# Altium schematic sheet 12V_to_0V9.SchDoc: 12V to 0V9 Converter
size B; DocumentNumber: 35; SheetNumber: 35; SheetTotal: 46
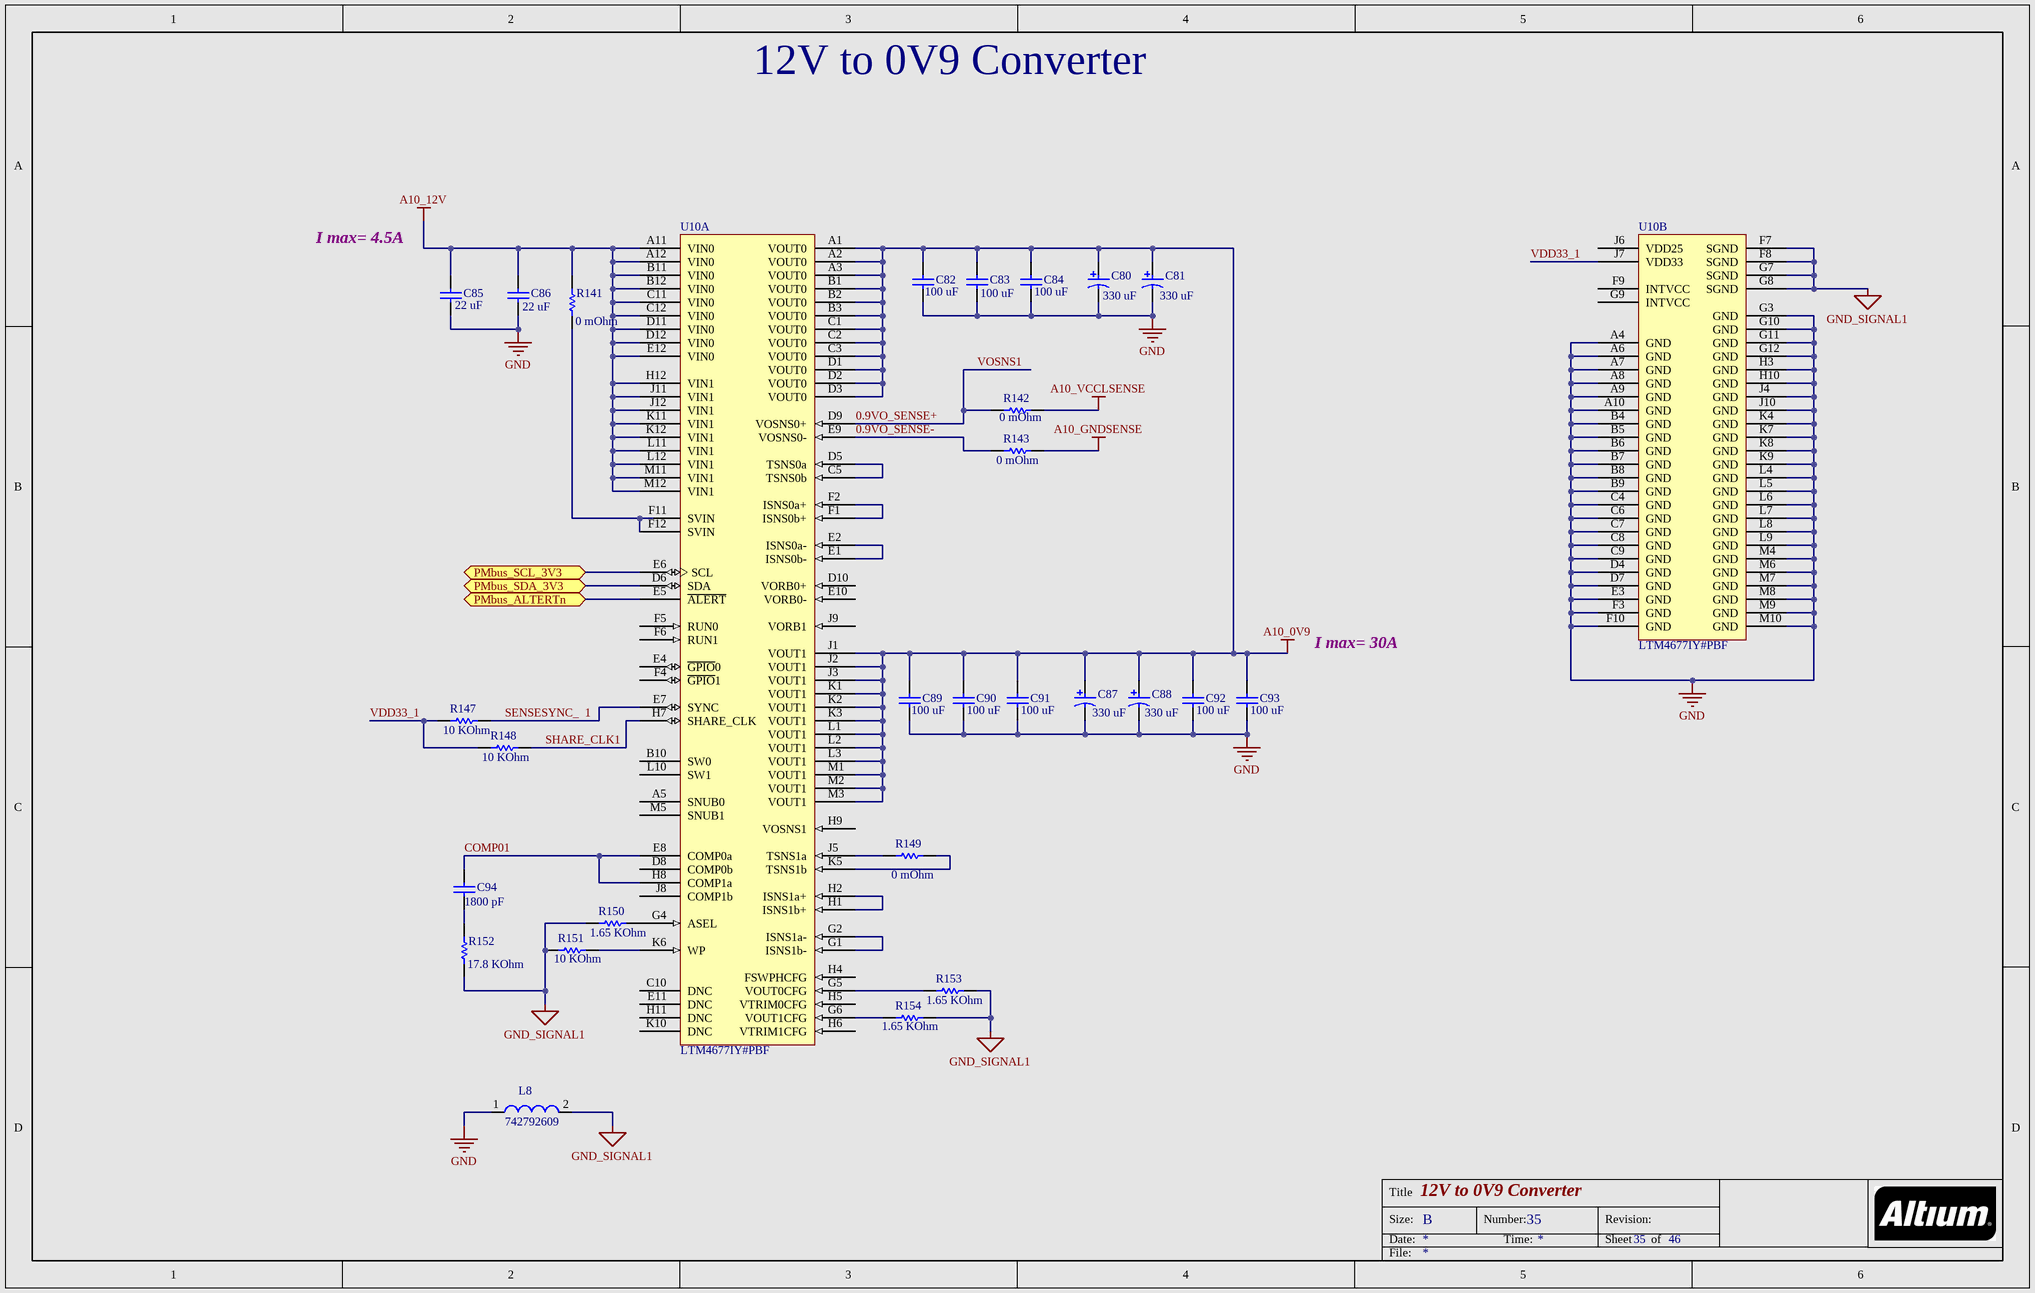
[diagram p0: 12V_to_0V9.SchDoc]

## Parts
(Parts that share a designator on the sheet are numbered #1, #2 ... from top to bottom, then left to right.)
C80  Capacitance: 330 uF  [PNSC-TPF-D3L_V]  (hidden comment: 6TPF330M9L)
C81  Capacitance: 330 uF  [PNSC-TPF-D3L_V]  (hidden comment: 6TPF330M9L)
C82  Capacitance: 100 uF  [CAPC3216X190X55ML30T25]  (hidden comment: GRM31CR60J107ME39L)
C83  Capacitance: 100 uF  [CAPC3216X190X55ML30T25]  (hidden comment: GRM31CR60J107ME39L)
C84  Capacitance: 100 uF  [CAPC3216X190X55ML30T25]  (hidden comment: GRM31CR60J107ME39L)
C85  Capacitance: 22 uF  [CAPC3216X180X55ML20T25]  (hidden comment: GRM31CR61E226KE15L)
C86  Capacitance: 22 uF  [CAPC3216X180X55ML20T25]  (hidden comment: GRM31CR61E226KE15L)
C87  Capacitance: 330 uF  [PNSC-TPF-D3L_V]  (hidden comment: 6TPF330M9L)
C88  Capacitance: 330 uF  [PNSC-TPF-D3L_V]  (hidden comment: 6TPF330M9L)
C89  Capacitance: 100 uF  [CAPC3216X190X55ML30T25]  (hidden comment: GRM31CR60J107ME39L)
C90  Capacitance: 100 uF  [CAPC3216X190X55ML30T25]  (hidden comment: GRM31CR60J107ME39L)
C91  Capacitance: 100 uF  [CAPC3216X190X55ML30T25]  (hidden comment: GRM31CR60J107ME39L)
C92  Capacitance: 100 uF  [CAPC3216X190X55ML30T25]  (hidden comment: GRM31CR60J107ME39L)
C93  Capacitance: 100 uF  [CAPC3216X190X55ML30T25]  (hidden comment: GRM31CR60J107ME39L)
C94  Capacitance: 1800 pF  [CAPC1005X55X23NL05T8]  (hidden comment: VJ0402Y182JXJCW1BC)
L8  742792609  [SMD-0603]
R141  Resistance: 0 mOhm  [RESC1005X40X25ML05T05]  (hidden comment: ERJ-2GE0R00X)
R142  Resistance: 0 mOhm  [RESC1005X40X25ML05T05]  (hidden comment: ERJ-2GE0R00X)
R143  Resistance: 0 mOhm  [RESC1005X40X25ML05T05]  (hidden comment: ERJ-2GE0R00X)
R147  Resistance: 10 KOhm  [RESC1005X40X25NL05T05]  (hidden comment: ERJ-2RKF1002X)
R148  Resistance: 10 KOhm  [RESC1005X40X25NL05T05]  (hidden comment: ERJ-2RKF1002X)
R149  Resistance: 0 mOhm  [RESC1005X40X25ML05T05]  (hidden comment: ERJ-2GE0R00X)
R150  Resistance: 1.65 KOhm  [RESC1005X40X25LL05T05]  (hidden comment: ERJ-2RKF1651X)
R151  Resistance: 10 KOhm  [RESC1005X40X25NL05T05]  (hidden comment: ERJ-2RKF1002X)
R152  Resistance: 17.8 KOhm  [RESC1005X40X25LL05T05]  (hidden comment: ERJ-2RKF1782X)
R153  Resistance: 1.65 KOhm  [RESC1005X40X25LL05T05]  (hidden comment: ERJ-2RKF1651X)
R154  Resistance: 1.65 KOhm  [RESC1005X40X25LL05T05]  (hidden comment: ERJ-2RKF1651X)
U10#1  LTM4677IY#PBF  [LT-BGA-144-05-08-1920_V]  (part A of 2)
U10#2  LTM4677IY#PBF  [LT-BGA-144-05-08-1920_V]  (part B of 2)

## Ports
PMbus_ALTERTn (bidir), PMbus_SCL_3V3 (bidir), PMbus_SDA_3V3 (bidir)

## Nets
A10_0V9: C80.1 C81.1 C82.2 C83.2 C84.2 C87.1 C88.1 C89.2 C90.2 C91.2 C92.2 C93.2 U10#1.A1(VOUT0) U10#1.A2(VOUT0) U10#1.A3(VOUT0) U10#1.B1(VOUT0) U10#1.B2(VOUT0) U10#1.B3(VOUT0) U10#1.C1(VOUT0) U10#1.C2(VOUT0) U10#1.C3(VOUT0) U10#1.D1(VOUT0) U10#1.D2(VOUT0) U10#1.D3(VOUT0) U10#1.J1(VOUT1) U10#1.J2(VOUT1) U10#1.J3(VOUT1) U10#1.K1(VOUT1) U10#1.K2(VOUT1) U10#1.K3(VOUT1) U10#1.L1(VOUT1) U10#1.L2(VOUT1) U10#1.L3(VOUT1) U10#1.M1(VOUT1) U10#1.M2(VOUT1) U10#1.M3(VOUT1)
A10_12V: C85.2 C86.2 R141.2 U10#1.A11(VIN0) U10#1.A12(VIN0) U10#1.B11(VIN0) U10#1.B12(VIN0) U10#1.C11(VIN0) U10#1.C12(VIN0) U10#1.D11(VIN0) U10#1.D12(VIN0) U10#1.E12(VIN0) U10#1.H12(VIN1) U10#1.J11(VIN1) U10#1.J12(VIN1) U10#1.K11(VIN1) U10#1.K12(VIN1) U10#1.L11(VIN1) U10#1.L12(VIN1) U10#1.M11(VIN1) U10#1.M12(VIN1)
A10_GNDSENSE: R143.2
A10_VCCLSENSE: R142.2
GND: C80.2 C81.2 C82.1 C83.1 C84.1 C85.1 C86.1 C87.2 C88.2 C89.1 C90.1 C91.1 C92.1 C93.1 L8.1 U10#2.A4(GND) U10#2.A6(GND) U10#2.A7(GND) U10#2.A8(GND) U10#2.A9(GND) U10#2.A10(GND) U10#2.B4(GND) U10#2.B5(GND) U10#2.B6(GND) U10#2.B7(GND) U10#2.B8(GND) U10#2.B9(GND) U10#2.C4(GND) U10#2.C6(GND) U10#2.C7(GND) U10#2.C8(GND) U10#2.C9(GND) U10#2.D4(GND) U10#2.D7(GND) U10#2.E3(GND) U10#2.F3(GND) U10#2.F10(GND) U10#2.G3(GND) U10#2.G10(GND) U10#2.G11(GND) U10#2.G12(GND) U10#2.H3(GND) U10#2.H10(GND) U10#2.J4(GND) U10#2.J10(GND) U10#2.K4(GND) U10#2.K7(GND) U10#2.K8(GND) U10#2.K9(GND) U10#2.L4(GND) U10#2.L5(GND) U10#2.L6(GND) U10#2.L7(GND) U10#2.L8(GND) U10#2.L9(GND) U10#2.M4(GND) U10#2.M6(GND) U10#2.M7(GND) U10#2.M8(GND) U10#2.M9(GND) U10#2.M10(GND)
GND_SIGNAL1: L8.2 R150.1 R151.2 R152.1 R153.2 R154.2 U10#2.F7(SGND) U10#2.F8(SGND) U10#2.G7(SGND) U10#2.G8(SGND)
0.9VO_SENSE+: R142.1 U10#1.D9(VOSNS0+)  [also labelled VOSNS1]
0.9VO_SENSE-: R143.1 U10#1.E9(VOSNS0-)
COMP01: C94.2 U10#1.E8(COMP0a) U10#1.H8(COMP1a)
PMbus_ALTERTn: U10#1.E5(~{ALERT}) ; port PMbus_ALTERTn
PMbus_SCL_3V3: U10#1.E6(SCL) ; port PMbus_SCL_3V3
PMbus_SDA_3V3: U10#1.D6(SDA) ; port PMbus_SDA_3V3
SENSESYNC_  1: R147.1 U10#1.E7(SYNC)
SHARE_CLK1: R148.1 U10#1.H7(SHARE_CLK)
VDD33_1: R147.2 R148.2 U10#2.J7(VDD33)
NetC94_1: C94.1 R152.2
NetR141_1: R141.1 U10#1.F11(SVIN) U10#1.F12(SVIN)
NetR149_1: R149.1 U10#1.J5(TSNS1a)
NetR149_2: R149.2 U10#1.K5(TSNS1b)
NetR150_2: R150.2 U10#1.G4(ASEL)
NetR151_1: R151.1 U10#1.K6(WP)
NetR153_1: R153.1 U10#1.G5(VOUT0CFG)
NetR154_1: R154.1 U10#1.G6(VOUT1CFG)
NetU10#1_C5: U10#1.C5(TSNS0b) U10#1.D5(TSNS0a)
NetU10#1_E1: U10#1.E1(ISNS0b-) U10#1.E2(ISNS0a-)
NetU10#1_F1: U10#1.F1(ISNS0b+) U10#1.F2(ISNS0a+)
NetU10#1_G1: U10#1.G1(ISNS1b-) U10#1.G2(ISNS1a-)
NetU10#1_H1: U10#1.H1(ISNS1b+) U10#1.H2(ISNS1a+)

Not connected (* = marked no-connect by the designer): U10#1 A5(SNUB0) B10(SW0) C10(DNC) D8(COMP0b) D10(VORB0+) E4(~{GPIO}0) E10(VORB0-) E11(DNC) F4(~{GPIO}1) F5(RUN0) F6(RUN1) H4(FSWPHCFG) H5(VTRIM0CFG) H6(VTRIM1CFG) H9(VOSNS1) H11(DNC) J8(COMP1b) J9(VORB1) K10(DNC) L10(SW1) M5(SNUB1); U10#2 F9(INTVCC) G9(INTVCC) J6(VDD25)

## Notes on the sheet
- I max= 4.5A
- I max= 30A
- Title
- Size:
- Date:
- B
- Number:
- Time:
- Revision:
- Sheet
- of
- File:

## Library data of the parts
C80 C81 C87 C88 = CMP-1665-00019-2: Tantalum Capacitor, 330 uF, +/- 20%, 6.3 V, -55 to 105 degC, 2-Pin Molded, RoHS, Tape and Reel; ComponentLink2Description: Datasheet; Radiation Hardening: No; ComponentLink1URL: http://www.panasonic.com/; Min Operating Temperature: -55 degC; Mounting Technology: Surface Mount; Mount: Surface Mount; ComponentLink2URL: http://industrial.panasonic.com/cdbs/www-data/pdf/AAA8000/AAA8000C38.pdf; Case/Package: 2917; ComponentLink3Description: Package Specification; PackageDescription: 2-Pin Molded Capacitor, Body 7.3 x 4.3 mm; Width: 0.169 inch; DatasheetVersion: 11/2015; Length: 0.287 inch; ComponentLink3URL: http://industrial.panasonic.com/cdbs/www-data/pdf/AAA8000/AAA8000COL34.pdf; Height: 2.8 mm; RoHSCompliant: True; ComponentLink1Description: Manufacturer URL; REACH SVHC: Unknown; Package Quantity: 2500; Max Operating Temperature: 105 degC; Packaging: Tape and Reel; PartNumber: 6TPF330M9L
C82-C84 C89-C93 = CMP-1662-00011-2: Chip Capacitor, 100 uF, +/- 20%, 6.3 V, -55 to 85 degC, 1206 (3216 Metric), RoHS, Tape and Reel; Voltage Rating: 6.3 V; Type (Capacitors): X5R; Case\/Package: 1206; Tolerance: 20%; ComponentLink1URL: http://www.murata.com/; ComponentLink1Description: Manufacturer URL; PackageDescription: 2-Pin Surface Mount Device, Body 3.2 x 1.6 mm; Max Operating Temperature: 85 degC; Case Code (Imperial): 1206; PackageReference: 1206; Height: 1.6 mm; Width: 1.6 mm; Packaging: Tape and Reel; DatasheetVersion: 09/2016; REACH SVHC: No SVHC; Mounting Technology: Surface Mount; Case Code (Metric): 3216; Min Operating Temperature: -55 degC; RoHSCompliant: true; Radiation Hardening: No; Voltage Rating (DC): 6.3 V; Package Quantity: 2000; ComponentLink2Description: Datasheet; Mount: Surface Mount; Length: 3.2 mm; ComponentLink2URL: http://psearch.en.murata.com/capacitor/product/GRM31CR60J107ME39%23.pdf; Pins: 2; PartNumber: GRM31CR60J107ME39L
C85 C86 = CMP-1662-00010-2: Chip Capacitor, 22 uF, +/- 10%, 25 V, -55 to 85 degC, 1206 (3216 Metric), RoHS, Tape and Reel; Voltage Rating (DC): 25 V; Case\/Package: 1206; Type (Capacitors): X5R; Tolerance: 10%; Max Operating Temperature: 85 degC; Package Quantity: 2000; Voltage Rating: 25 V; Case Code (Metric): 3216; Length: 3.2 mm; PackageDescription: 2-Pin Surface Mount Device, Body 3.2 x 1.6 mm; ComponentLink1Description: Manufacturer URL; Case Code (Imperial): 1206; ComponentLink1URL: http://www.murata.com/; Radiation Hardening: No; Height: 1.6 mm; Width: 1.6 mm; DatasheetVersion: 03/2016; Min Operating Temperature: -55 degC; Mount: Surface Mount; REACH SVHC: No SVHC; PackageReference: 1206; ComponentLink2URL: http://search.murata.co.jp/Ceramy/image/img/A01X/G101/ENG/GRM31CR61E226KE15-01.pdf; Packaging: Tape and Reel; RoHSCompliant: true; ComponentLink2Description: Datasheet; Mounting Technology: Surface Mount; PartNumber: GRM31CR61E226KE15L; Pins: 2
C94 = CMP-1666-00016-3: Chip Capacitor, 1.8 nF, +/- 5%, 16 V, -55 to 125 degC, 0402 (1005 Metric), RoHS, Tape and Reel; Voltage Rating (DC): 16 V; Case\/Package: 0402; Type (Capacitors): X7R; Tolerance: 5%; RoHSCompliant: true; ComponentLink1URL: http://www.vishay.com/; Max Operating Temperature: 125 degC; PackageDescription: 2-Pin Surface Mount Device, Body 1 x 0.5 mm; ComponentLink1Description: Manufacturer URL; Case Code (Imperial): 0402; Length: 1 mm; Min Operating Temperature: -55 degC; Mounting Technology: Surface Mount; ComponentLink2Description: Datasheet; Width: 0.5 mm; Packaging: Tape and Reel; Case Code (Metric): 1005; Height: 0.5 mm; PartNumber: VJ0402Y182JXJCW1BC; Package Quantity: 10000; ComponentLink2URL: http://www.vishay.com/docs/28548/vjw1bcbascomseries.pdf; DatasheetVersion: 07/2016; Mount: Surface Mount; Pins: 2; Voltage Rating: 16 V; PackageReference: 0402
L8 = CMP-0220-00193-1: SMD EMI Suppression Ferrite Bead WE-CBF, Z = 30 Ohm; Impedance: 30 Ohm; ComponentLink2URL: http://www.we-online.de/katalog/media/pdf/742792609.pdf; ComponentLink1URL: http://www.we-online.com; ComponentLink2Description: Datasheet; PackageDescription: Chip Inductor, 2-Leads, Body 1.6 x 0.8 mm; ComponentLink1Description: Manufacturer Link; PackageReference: SMD-0603; DatasheetVersion: Dec-2005; PackageVersion: 2009
R141-R143 R149 = CMP-2002-00429-3: Chip Resistor, 0 mOhm, +/- 5%, 100 mW, -55 to 155 degC, 0402 (1005 Metric), RoHS, Tape and Reel; Manufacturer: Basic Passives; Power Rating: 100 mW; Voltage Rating: 50 V; Case\/Package: 0402; Max Operating Temperature: 155 degC; Tolerance: 5%; PartNumber: ERJ-2GE0R00X; Case Code (Imperial): 0402; Package Quantity: 10000; Length: 1 mm; Mounting Technology: Surface Mount; ComponentLink1URL: http://www.panasonic.com/; Height: 0.35 mm; Width: 0.5 mm; Min Operating Temperature: -55 degC; Case Code (Metric): 1005; RoHSCompliant: true; REACH SVHC: Unknown; ComponentLink1Description: Manufacturer URL; Packaging: Tape and Reel; Mount: Surface Mount; PackageDescription: 2-Pin Surface Mount Device, Body 1 x 0.5 mm; PackageReference: 0402; ComponentLink2URL: http://industrial.panasonic.com/cdbs/www-data/pdf/RDA0000/AOA0000C84.pdf; DatasheetVersion: 03/2015; Radiation Hardening: No; Pins: 2; ComponentLink2Description: Datasheet
R147 R148 R151 = CMP-2002-00607-3: Chip Resistor, 10 KOhm, +/- 1%, 100 mW, -55 to 155 degC, 0402 (1005 Metric), RoHS, Tape and Reel; Manufacturer: Basic Passives; Voltage Rating: 50 V; Power Rating: 100 mW; Case\/Package: 0402; Case Code (Imperial): 0402; Min Operating Temperature: -55 degC; PartNumber: ERJ-2RKF1002X; Mounting Technology: Surface Mount; Length: 1 mm; Packaging: Tape and Reel; ComponentLink1Description: Manufacturer URL; Mount: Surface Mount; Package Quantity: 10000; Max Operating Temperature: 155 degC; Case Code (Metric): 1005; Height: 0.35 mm; ComponentLink1URL: http://www.panasonic.com/; Tolerance: 1%; REACH SVHC: Yes; RoHSCompliant: true; Width: 0.5 mm; PackageDescription: 2-Pin Surface Mount Device, Body 1 x 0.5 mm; Radiation Hardening: No; PackageReference: 0402; ComponentLink2Description: Datasheet; DatasheetVersion: 04/2015; ComponentLink2URL: http://industrial.panasonic.com/cdbs/www-data/pdf/RDA0000/AOA0000C86.pdf; Pins: 2
R150 R153 R154 = CMP-2002-00716-3: Chip Resistor, 1.65 KOhm, +/- 1%, 100 mW, -55 to 155 degC, 0402 (1005 Metric), RoHS, Tape and Reel; Manufacturer: Basic Passives; Voltage Rating: 50 V; Power Rating: 100 mW; Case\/Package: 0402; Tolerance: 1%; ComponentLink1URL: http://www.panasonic.com/; RoHSCompliant: true; Package Quantity: 10000; REACH SVHC: Yes; Packaging: Tape and Reel; Mount: Surface Mount; PartNumber: ERJ-2RKF1651X; Case Code (Imperial): 0402; Height: 0.35 mm; Min Operating Temperature: -55 degC; ComponentLink1Description: Manufacturer URL; Mounting Technology: Surface Mount; Width: 0.5 mm; PackageDescription: 2-Pin Surface Mount Device, Body 1 x 0.5 mm; Max Operating Temperature: 155 degC; Case Code (Metric): 1005; Length: 1 mm; PackageReference: 0402; DatasheetVersion: 04/2015; ComponentLink2URL: http://industrial.panasonic.com/cdbs/www-data/pdf/RDA0000/AOA0000C86.pdf; ComponentLink2Description: Datasheet; Pins: 2
R152 = CMP-2002-00732-3: Chip Resistor, 17.8 KOhm, +/- 1%, 100 mW, -55 to 155 degC, 0402 (1005 Metric), RoHS, Tape and Reel; Manufacturer: Basic Passives; Power Rating: 100 mW; Voltage Rating: 50 V; Case\/Package: 0402; Package Quantity: 10000; ComponentLink1URL: http://www.panasonic.com/; PackageDescription: 2-Pin Surface Mount Device, Body 1 x 0.5 mm; Packaging: Tape and Reel; Case Code (Metric): 1005; Tolerance: 1%; ComponentLink1Description: Manufacturer URL; Mount: Surface Mount; RoHSCompliant: true; REACH SVHC: Unknown; Height: 0.35 mm; Case Code (Imperial): 0402; PartNumber: ERJ-2RKF1782X; Min Operating Temperature: -55 degC; Max Operating Temperature: 155 degC; Length: 1 mm; Mounting Technology: Surface Mount; Width: 0.5 mm; DatasheetVersion: 04/2015; ComponentLink2Description: Datasheet; Pins: 2; ComponentLink2URL: http://industrial.panasonic.com/cdbs/www-data/pdf/RDA0000/AOA0000C86.pdf; PackageReference: 0402
U10#1 U10#2 = CMP-1701-00001-1: Dual 18 A or Single 36 A uModule Regulator with Digital Power System Management, 4.5 to 16 V Input, 0.5 to 1.8 V Output, -40 to 125 degC, 144-Ball BGA, RoHS, Tray; Manufacturer: Linear Technology; ComponentLink1Description: Manufacturer URL; PartNumber: LTM4677IY#PBF; PackageVersion: Rev. B, 02/2013; ComponentLink3URL: http://www.linear.com/docs/41077; ComponentLink2URL: http://cds.linear.com/docs/en/datasheet/4677f.pdf; ComponentLink1URL: http://www.linear.com/; Mounting Technology: Surface Mount; ComponentLink2Description: Datasheet; PackageReference: BGA-144; PackageDescription: 144-Ball Ball Grid Array, Body 16 x 16 mm, Pitch 1.27 mm; ComponentLink3Description: Package Specification; DatasheetVersion: Rev. F; PartId: 1